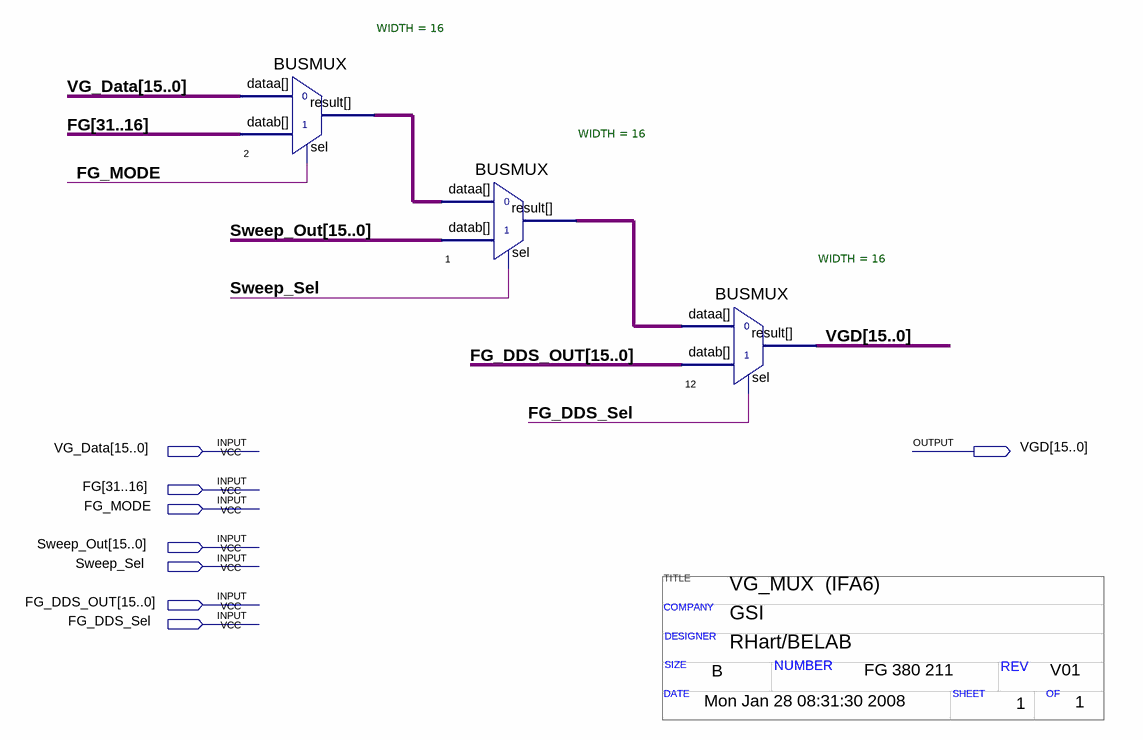
[diagram p0: schematic sheet]
// Quartus schematic vg_mux.bdf as structural Verilog: 3 symbols, 8 pins
// Title block: TITLE: VG_MUX  (IFA6); COMPANY: GSI; DESIGNER: RHart/BELAB; SIZE: B; NUMBER: FG 380 211; REV: V01; DATE: Mon Jan 28 08:31:30 2008; SHEET: 1; OF: 1
module vg_mux (
  input  [15:0] VG_Data,
  input  [31:16] FG,
  input  FG_MODE,
  input  [15:0] Sweep_Out,
  input  Sweep_Sel,
  input  [15:0] FG_DDS_OUT,
  input  FG_DDS_Sel,
  output [15:0] VGD
);

  wire [15:0] n1_result, n2_result;

  BUSMUX #(.WIDTH(16)) u_2 (.datab(FG), .sel(FG_MODE), .dataa(VG_Data), .result(n2_result));
  BUSMUX #(.WIDTH(16)) u_1 (.datab(Sweep_Out), .sel(Sweep_Sel), .dataa(n2_result), .result(n1_result));
  BUSMUX #(.WIDTH(16)) u_12 (.datab(FG_DDS_OUT), .sel(FG_DDS_Sel), .dataa(n1_result), .result(VGD));
endmodule
